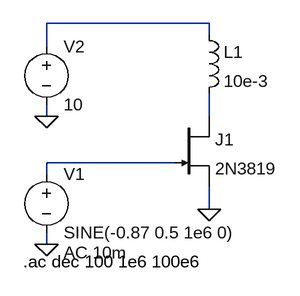
[diagram p0: schematic curva_fet.asc]
curva_fet.asc, the LTspice schematic file:
Version 4
SHEET 1 880 680
WIRE 48 -32 -176 -32
WIRE 48 -16 48 -32
WIRE -176 0 -176 -32
WIRE -176 96 -176 80
WIRE 48 96 48 64
WIRE 0 160 -176 160
WIRE -176 176 -176 160
WIRE 48 224 48 192
WIRE -176 272 -176 256
FLAG 48 224 0
FLAG -176 96 0
FLAG -176 272 0
SYMBOL njf 0 96 R0
SYMATTR InstName J1
SYMATTR Value 2N3819
SYMBOL voltage -176 160 R0
WINDOW 123 24 124 Left 2
WINDOW 39 0 0 Left 0
SYMATTR Value2 AC 10m
SYMATTR InstName V1
SYMATTR Value SINE(-0.87 0.5 1e6 0)
SYMBOL voltage -176 -16 R0
WINDOW 123 0 0 Left 0
WINDOW 39 0 0 Left 0
SYMATTR InstName V2
SYMATTR Value 10
SYMBOL ind 32 -32 R0
SYMATTR InstName L1
SYMATTR Value 10e-3
TEXT -208 296 Left 2 !.ac dec 100 1e6 100e6

The netlist it stands for:
* curva_fet.asc
J1 N002 N003 0 2N3819
V1 N003 0 SINE(-0.87 0.5 1e6 0) AC 10m
V2 N001 0 10
L1 N001 N002 10e-3
.model NJF NJF
.model PJF PJF
.lib standard.jft
.ac dec 100 1e6 100e6
.backanno
.end